# Altium project Spatial Breakout.PrjPcb
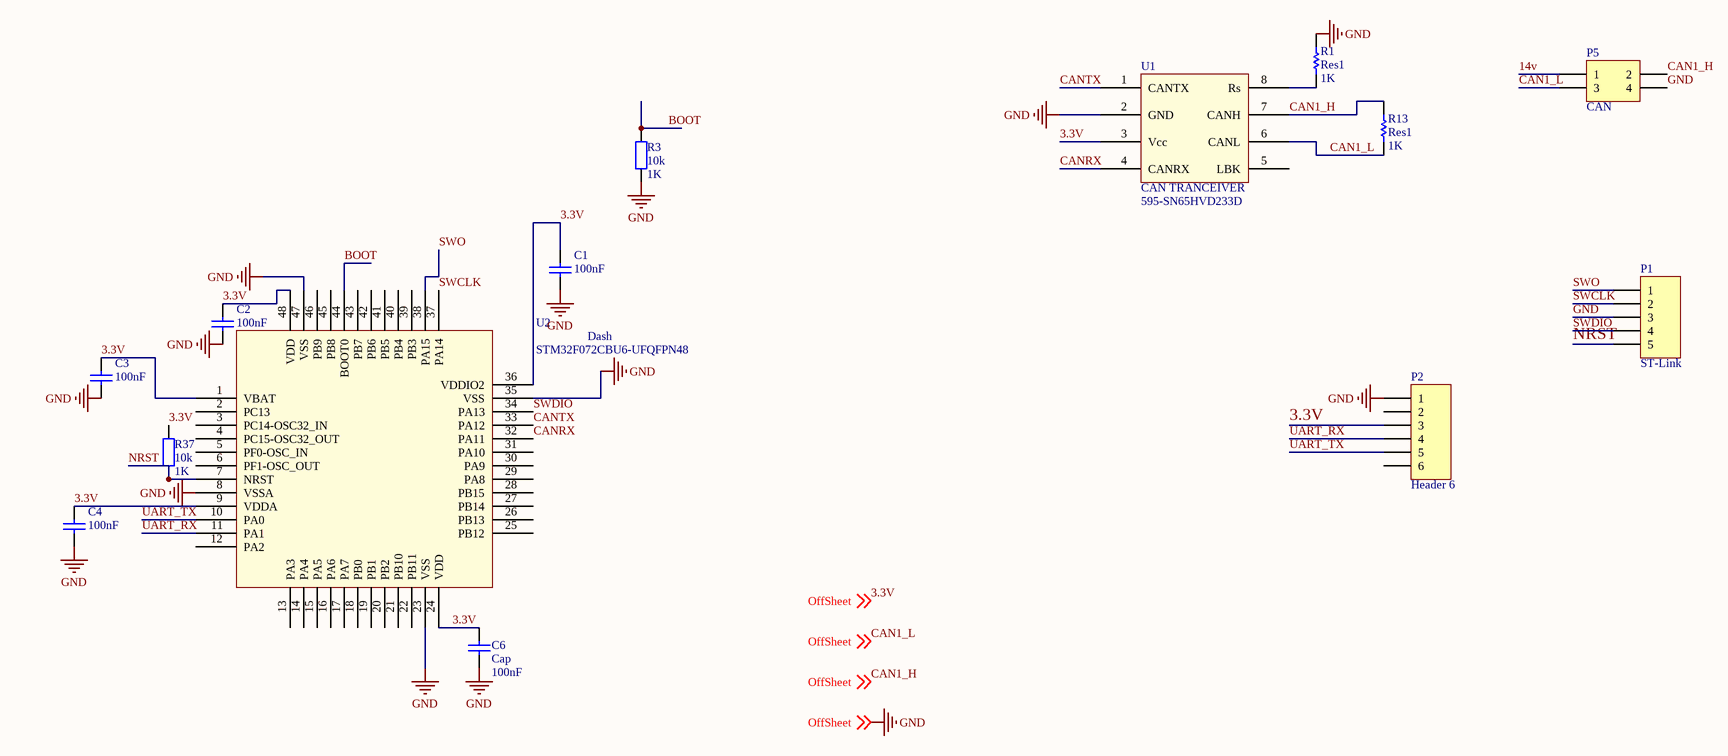
[diagram p0: Spatial Breakout.SchDoc]
1 sheet, 14 parts. Net scope: global (net labels, ports and power ports of the same name join across sheets).
Board file: Spatial Breakout.PcbDoc

## Sheet Spatial Breakout.SchDoc
size A3

### Parts
C1  value 100nF  [R0805]
C2  value 100nF  [R0805]
C3  value 100nF  [R0805]
C4  value 100nF  [R0805]
C6  Cap  value 100nF  [R0805]
P1  ST-Link  [SMD 5Wire - Small]
P2  Header 6  [HDR1X6]
P5  CAN  [SMD 4Wire]
R1  Res1  value 1K  [R0805]
R3  10k  value 1K  [R0805]
R13  Res1  value 1K  [R0805]
R37  10k  value 1K  [R0805]
U1  CAN TRANCEIVER  Supplier Part Number 1: 595-SN65HVD233D  [SOP8]
U2  Dash  Part Number: STM32F072CBU6-UFQFPN48  [STM32F072CBU6 - No Heatsink]

### Nets
3.3V: C1.1 C1.2 C2.1 C2.2 C3.1 C3.2 C4.1 C4.2 C6.1 C6.2 P1.3 P2.1 P2.3 P5.2 P5.3 P5.4 R1.2 R3.1 R13.1 R13.2 R37.2 U1.2(GND) U1.3(Vcc) U1.6(CANL) U1.7(CANH) U2.1(VBAT) U2.8(VSSA) U2.9(VDDA) U2.23(VSS) U2.24(VDD) U2.35(VSS) U2.36(VDDIO2) U2.47(VSS) U2.48(VDD) ; off-sheet OffSheet  [also labelled CAN1_H, CAN1_L, GND, OffSheet]
14v: P5.1
BOOT: R3.2 U2.44(BOOT0)
CANRX: U1.4(CANRX) U2.32(PA11)
CANTX: U1.1(CANTX) U2.33(PA12)
NRST: P1.5 R37.1 U2.7(NRST)
SWCLK: P1.2 U2.37(PA14)
SWDIO: P1.4 U2.34(PA13)
SWO: P1.1 U2.38(PA15)
UART_RX: P2.4 U2.11(PA1)
UART_TX: P2.5 U2.10(PA0)
NetR1_1: R1.1 U1.8(Rs)

Not connected (* = marked no-connect by the designer): P2 2 6; U1 5(LBK); U2 2(PC13) 3(PC14-OSC32_IN) 4(PC15-OSC32_OUT) 5(PF0-OSC_IN) 6(PF1-OSC_OUT) 12(PA2) 13(PA3) 14(PA4) 15(PA5) 16(PA6) 17(PA7) 18(PB0) 19(PB1) 20(PB2) 21(PB10) 22(PB11) 25(PB12) 26(PB13) 27(PB14) 28(PB15) 29(PA8) 30(PA9) 31(PA10) 39(PB3) 40(PB4) 41(PB5) 42(PB6) 43(PB7) 45(PB8) 46(PB9)

### Library data of the parts
C1-C4 = Cap Semi: Capacitor (Semiconductor SIM Model); Published: 8-Jun-2000; LatestRevisionDate: 29-May-2009; LatestRevisionNote: IPC-7351 Footprint Added.; PackageReference: C1206; Publisher: Altium Limited; PackageDescription: Chip Capacitor
C6 = Cap: Capacitor; Published: 8-Jun-2000; LatestRevisionDate: 17-Jul-2002; LatestRevisionNote: Re-released for DXP Platform.; PackageReference: RAD-0.3; Publisher: Altium Limited; PackageDescription: Radial Cap, Thru-Hole; 2 Leads; 0.3 in Pin Spacing
P1 = Header 5: Header, 5-Pin; LatestRevisionDate: 17-Jul-2002; LatestRevisionNote: Re-released for DXP Platform.; Publisher: Altium Limited
P2 = Header 6: Header, 6-Pin; LatestRevisionDate: 17-Jul-2002; LatestRevisionNote: Re-released for DXP Platform.; Publisher: Altium Limited
P5 = Header 2X2H: Header, 2-Pin, Dual row, Right Angle; LatestRevisionDate: 17-Jul-2002; LatestRevisionNote: Re-released for DXP Platform.; Publisher: Altium Limited
R1 R13 = Res1: Resistor; Published: 8-Jun-2000; LatestRevisionDate: 17-Jul-2002; LatestRevisionNote: Re-released for DXP Platform.; PackageReference: AXIAL-0.3; Publisher: Altium Limited; PackageDescription: Axial Device, Thru-Hole; 2 Leads; 0.3 in Pin Spacing
R3 R37 = Res2: Resistor; Published: 8-Jun-2000; LatestRevisionDate: 17-Jul-2002; LatestRevisionNote: Re-released for DXP Platform.; PackageReference: AXIAL-0.4; Publisher: Altium Limited; PackageDescription: Axial Device, Thru-Hole; 2 Leads; 0.4 in Pin Spacing
U1 = 595-SN65HVD233: Supplier 1: Mouser
U2 = STM32F072CBU6: PDM Mk21 MICRO; Manufacturer: ST Microelectrics; Supplier: RS Components